# Altium schematic sheet Power.SchDoc
size A
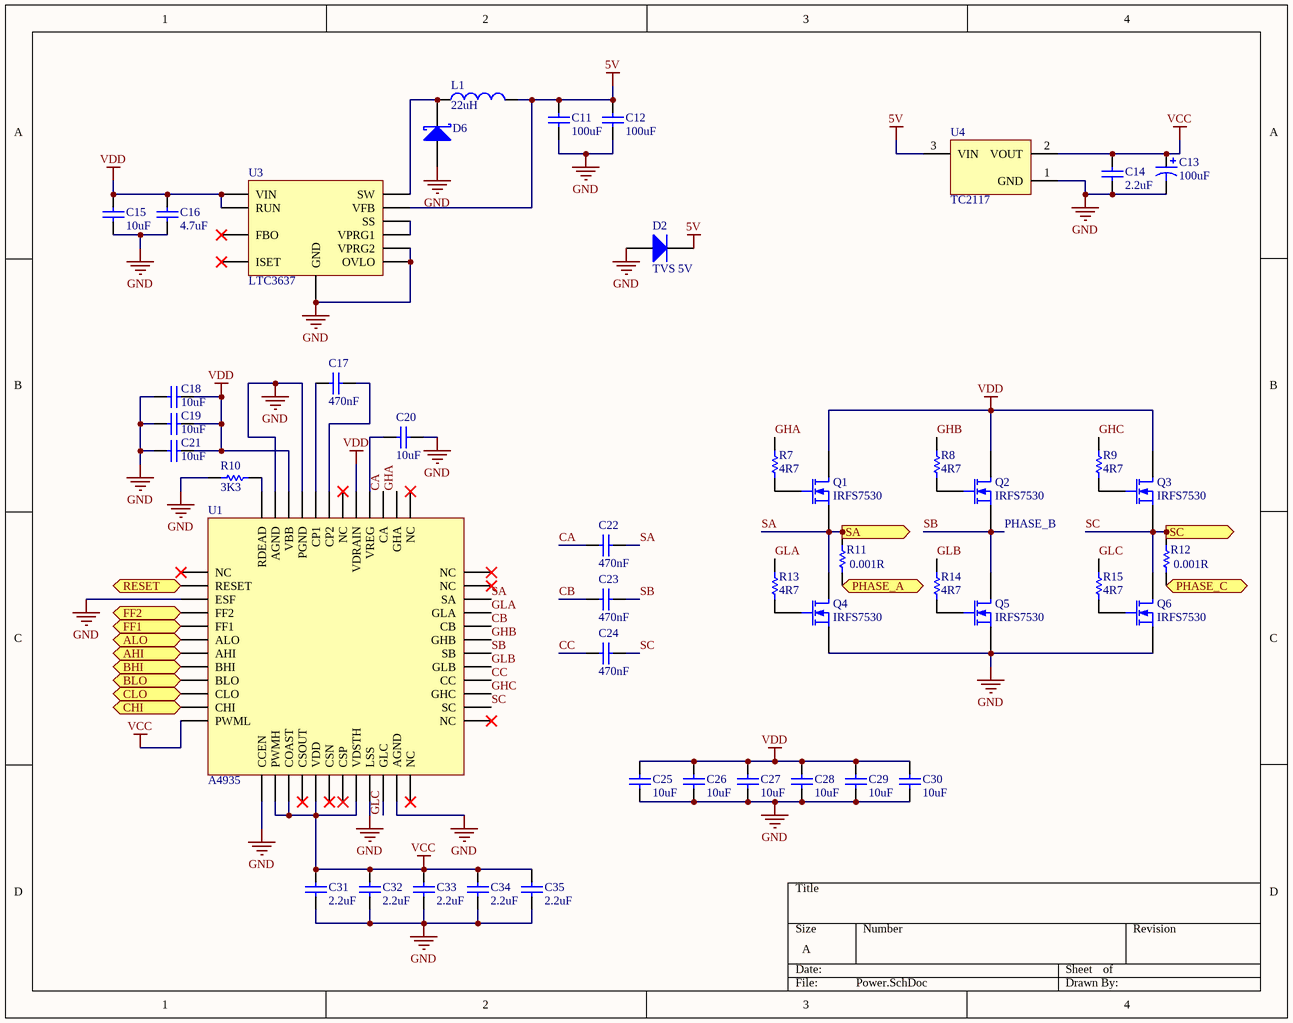
[diagram p0: Power.SchDoc]

## Parts
C11  100uF  [CAPC1210(3225)280_N]
C12  100uF  [CAPC1210(3225)280_N]
C13  100uF  [AVX-CAPC7343_V]
C14  2.2uF  [CAPC0603(1608)55_N]
C15  10uF  [CAPC1206(3216)190_M]
C16  4.7uF  [CAPC0805(2012)145_N]
C17  470nF  [CAPC0603(1608)100_N]
C18  10uF  [CAPC1206(3216)190_M]
C19  10uF  [CAPC1206(3216)190_M]
C20  10uF  [CAPC0805(2012)145_N]
C21  10uF  [CAPC1206(3216)190_M]
C22  470nF  [CAPC0603(1608)100_L]
C23  470nF  [CAPC0603(1608)100_L]
C24  470nF  [CAPC0603(1608)100_L]
C25  10uF  [CAPC1206(3216)190_M]
C26  10uF  [CAPC1206(3216)190_M]
C27  10uF  [CAPC1206(3216)190_M]
C28  10uF  [CAPC1206(3216)190_M]
C29  10uF  [CAPC1206(3216)190_M]
C30  10uF  [CAPC1206(3216)190_M]
C31  2.2uF  [CAPC0603(1608)55_N]
C32  2.2uF  [CAPC0603(1608)55_N]
C33  2.2uF  [CAPC0603(1608)55_N]
C34  2.2uF  [CAPC0603(1608)55_N]
C35  2.2uF  [CAPC0603(1608)55_N]
D2  TVS 5V  [VISH-DO-214AC-2_N]
D6  (no value)  [SMB]
L1  value 22uH  [SDR0805-180ML]  (hidden comment: SDR0805-180ML)
Q1  IRFS7530  [DPAK127P1525X483-7N]
Q2  IRFS7530  [DPAK127P1525X483-7N]
Q3  IRFS7530  [DPAK127P1525X483-7N]
Q4  IRFS7530  [DPAK127P1525X483-7N]
Q5  IRFS7530  [DPAK127P1525X483-7N]
Q6  IRFS7530  [DPAK127P1525X483-7N]
R7  4R7  [RESC0603(1608)_N]
R8  4R7  [RESC0603(1608)_N]
R9  4R7  [RESC0603(1608)_N]
R10  3K3  [RESC0603(1608)_N]
R11  value 0.001R  [Shunt]
R12  value 0.001R  [Shunt]
R13  4R7  [RESC0603(1608)_N]
R14  4R7  [RESC0603(1608)_N]
R15  4R7  [RESC0603(1608)_N]
U1  A4935  [LQFP-48]
U3  LTC3637  [SON50P300X85_HS-17N]
U4  TC2117  [SOT-223-DB3_M]

## Ports
AHI (in), ALO (in), BHI (in), BLO (in), CHI (in), CLO (in), FF1 (out), FF2 (out), PHASE_A (out), PHASE_C (out), RESET (in), SA (out), SC (out)

## Nets
5V: C11.2 C12.2 D2.1(K) L1.2 U3.9(VFB) U4.3(VIN)
GND: C11.1 C12.1 C13.2 C14.2 C15.1 C16.2 C18.1 C19.1 C20.2 C21.1 C25.1 C26.1 C27.1 C28.1 C29.1 C30.1 C31.1 C32.1 C33.1 C34.1 C35.1 D2.2(A) D6.1(A) Q4.3(S) Q5.3(S) Q6.3(S) R10.1 U1.3(ESF) U1.13(CCEN) U1.21(LSS) U1.23(AGND) U1.45(PGND) U1.47(AGND) U3.6(VPRG2) U3.12(OVLO) U3.17(GND) U4.1(GND)
VCC: C13.1 C14.1 C31.2 C32.2 C33.2 C34.2 C35.2 U1.12(PWML) U1.14(PWMH) U1.15(COAST) U1.17(VDD) U1.20(VDSTH) U4.2(VOUT)
VDD: C15.2 C16.1 C18.2 C19.2 C21.2 C25.2 C26.2 C27.2 C28.2 C29.2 C30.2 Q1.1(D) Q2.1(D) Q3.1(D) U1.41(VDRAIN) U1.46(VBB) U3.3(VIN) U3.14(RUN)
AHI: U1.7(AHI) ; port AHI
ALO: U1.6(ALO) ; port ALO
BHI: U1.8(BHI) ; port BHI
BLO: U1.9(BLO) ; port BLO
CA: C22.1 U1.39(CA)
CB: C23.1 U1.32(CB)
CC: C24.1 U1.28(CC)
CHI: U1.11(CHI) ; port CHI
CLO: U1.10(CLO) ; port CLO
FF1: U1.5(FF1) ; port FF1
FF2: U1.4(FF2) ; port FF2
GHA: R7.2 U1.38(GHA)
GHB: R8.2 U1.31(GHB)
GHC: R9.2 U1.27(GHC)
GLA: R13.2 U1.33(GLA)
GLB: R14.2 U1.29(GLB)
GLC: R15.2 U1.22(GLC)
PHASE_A: R11.1 ; port PHASE_A
PHASE_C: R12.1 ; port PHASE_C
RESET: U1.2(RESET) ; port RESET
SA: C22.2 Q1.3(S) Q4.1(D) R11.2 U1.34(SA) ; port SA
SB: C23.2 Q2.3(S) Q5.1(D) U1.30(SB)
SC: C24.2 Q3.3(S) Q6.1(D) R12.2 U1.26(SC) ; port SC
NetC17_1: C17.1 U1.44(CP1)
NetC17_2: C17.2 U1.43(CP2)
NetC20_1: C20.1 U1.40(VREG)
NetD6_2: D6.2(K) L1.1 U3.1(SW)
NetQ1_2: Q1.2(G) R7.1
NetQ2_2: Q2.2(G) R8.1
NetQ3_2: Q3.2(G) R9.1
NetQ4_2: Q4.2(G) R13.1
NetQ5_2: Q5.2(G) R14.1
NetQ6_2: Q6.2(G) R15.1
NetR10_2: R10.2 U1.48(RDEAD)
NetU3_7: U3.7(VPRG1) U3.10(SS)

Not connected (* = marked no-connect by the designer): U1 1(NC)* 16(CSOUT)* 18(CSN)* 19(CSP)* 24(NC)* 25(NC)* 35(NC)* 36(NC)* 37(NC)* 42(NC)*; U3 5(FBO)* 11(ISET)*

## Notes on the sheet
- (near Q2) PHASE_B

## Library data of the parts
C11 C12 = CMP-1038-02301-1: CAP 100uF 10V Â±10% 1210 (3225 Metric) Thickness 2.8mm SMD; Case-EIA: 1210; Case-Metric: 3225; Rated Voltage: 6.3 V; Value: 100uF; Tolerance: Â±10%; Technology: SMT; Max Thickness: 2.8 mm
C13 = AVX-CAP-P-2
C14 C31-C35 = CMP-1035-02762-1: CAP 2.2uF 16V Â±10% 0603 (1608 Metric) Thickness 0.55mm SMD; Case-EIA: 0603; Case-Metric: 1608; Max Thickness: 0.55 mm; Technology: SMT; Value: 2.2uF; Rated Voltage: 16 V; Tolerance: Â±10%
C15 C18 C19 C21 C25-C30 = CMP-1037-04982-1: CAP 10uF 50V Â±10% 1206 (3216 Metric) Thickness 1.9mm SMD; Case-EIA: 1206; Case-Metric: 3216; Technology: SMT; Tolerance: Â±10%; Max Thickness: 1.9 mm; Value: 10uF; Rated Voltage: 50 V
C16 = CMP-1036-04900-1: CAP 4.7uF 50V Â±10% 0805 (2012 Metric) Thickness 1.45mm SMD; Case-Metric: 2012; Case-EIA: 0805; Value: 4.7uF; Tolerance: Â±10%; Technology: SMT; Max Thickness: 1.45 mm; Rated Voltage: 50 V
C17 = CMP-1035-02704-1: CAP 470nF 25V Â±20% 0603 (1608 Metric) Thickness 1mm SMD; Case-Metric: 1608; Case-EIA: 0603; Technology: SMT; Rated Voltage: 25 V; Max Thickness: 1 mm; Value: 470nF; Tolerance: Â±20%
C20 = CMP-1036-04932-1: CAP 10uF 25V Â±10% 0805 (2012 Metric) Thickness 1.45mm SMD; Case-EIA: 0805; Case-Metric: 2012; Technology: SMT; Value: 10uF; Rated Voltage: 25 V; Max Thickness: 1.45 mm; Tolerance: Â±10%
C22-C24 = CMP-1035-02703-1: CAP 470nF 25V Â±10% 0603 (1608 Metric) Thickness 1mm SMD; Case-Metric: 1608; Case-EIA: 0603; Tolerance: Â±10%; Rated Voltage: 25 V; Max Thickness: 1 mm; Technology: SMT; Value: 470nF
D2 = CMP-0548-00235-1: Transient Voltage Suppressor, 6.40 to 231 V, 5 V Stand-off Voltage, Uni-Directional, -55 to 155 degC, 2-pin DO-214AC, Pb-Free, Tape and Reel; PartNumber: SMAJ5.0A-E3/61; Manufacturer: Vishay Semiconductor; ID (uA): 800; IFSM: 40 A; VBR Uni-Directional (V): 6.4 to 231; PPPM (W): 400, 300; VWM (V): 5; PackageDescription: 2-Pin DO-214AC (SMA), Body 4.245 x 2.665 mm; Mounting Technology: Surface Mount; ComponentLink3Description: Package Specification; ComponentLink1URL: http://www.vishay.com/; Operating Junction and Storage Temperature Range: -55 to 150 degC; PackageReference: DO-214AC-2; ComponentLink2URL: http://www.vishay.com/docs/88390/smaj50a.pdf; Packing: Tape and Reel; RoHS: TRUE; DatasheetVersion: 12/8/2013; ComponentLink3URL: http://www.vishay.com/docs/88390/smaj50a.pdf; ComponentLink1Description: Manufacturer URL; ComponentLink2Description: Datasheet
D6 = D Schottky: Schottky Diode; Published: 8-Jun-2000; LatestRevisionDate: 17-Jul-2002; LatestRevisionNote: Re-released for DXP Platform.; PackageReference: SMB; Publisher: Altium Limited; PackageDescription: DO-214-AA/SMB; 2 C-Bend Leads; Body 5.3 x 3.6 mm, inc. leads (LxW); Code_JEDEC: DO-214-AA
L1 = SDR0805-180ML: Inductor; Code_IEC: 1005; Published: 8-Jun-2000; LatestRevisionDate: 29-May-2009; LatestRevisionNote: IPC-7351 Footprint Added.; PackageReference: 0402-A; Publisher: Altium Limited; PackageDescription: Chip Inductor; Code_JEITA: 0402
Q1-Q6 = IRFS7530: N-Channel MOSFET; pin to pad: 1>8 2>1 3>2+3+5+6+7; Published: 8-Jun-2000; LatestRevisionDate: 17-Jul-2002; LatestRevisionNote: Re-released for DXP Platform.; PackageVersion: 1995/1996; PackageReference: E3; Publisher: Altium Limited; PackageDescription: TO, Flat Index; 3 In-Line, Axial Leads; Body Dia. 4.6mm; Lead Dia. 0.5 mm (max)
R7-R9 R13-R15 = CMP-1012-00018-1: 4R7 0.1W 5% 0603 (1608 Metric)  SMD; Value: 4.70 Ohm; Case-EIA: 0603; Case-Metric: 1608; Power: 0.1 W; Tolerance: 5 %; Technology: SMT
R10 = CMP-1012-00086-1: 3K3 0.1W 5% 0603 (1608 Metric)  SMD; Case-EIA: 0603; Value: 3300.00 Ohm; Case-Metric: 1608; Technology: SMT; Tolerance: 5 %; Power: 0.1 W
R11 = Shunt: 0.001R; Published: 8-Jun-2000; LatestRevisionDate: 17-Jul-2002; LatestRevisionNote: Re-released for DXP Platform.; PackageReference: AXIAL-0.3; Publisher: Altium Limited; PackageDescription: Axial Device, Thru-Hole; 2 Leads; 0.3 in Pin Spacing
R12 = Shunt: Resistor; Published: 8-Jun-2000; LatestRevisionDate: 17-Jul-2002; LatestRevisionNote: Re-released for DXP Platform.; PackageReference: AXIAL-0.3; Publisher: Altium Limited; PackageDescription: Axial Device, Thru-Hole; 2 Leads; 0.3 in Pin Spacing
U1 = A4935: pin to pad: 23>23+47+49 47>47+23+49
U3 = LTC3637: pin to pad: 17>8+16+17
U4 = PM-LINEREG-TC2117-IL4: pin to pad: 2>2+4